# EAGLE design xbeeRFsocket-v01 (EAGLE 5.11)
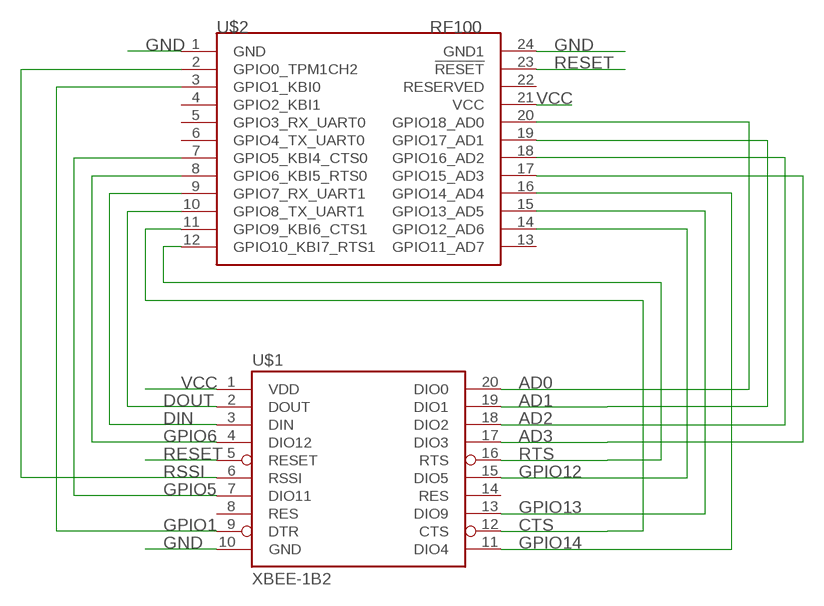
[diagram p0: schematic, sheet 1]

## Parts
U$1  XBEE-1B2  [XBEE-SILK]
U$2  SYNAPSEWIRELESS-RFENGINE  [SYNAPSERFENGINE-THM-SMT]

## Nets
AD0: U$1.20(DIO0) U$2.20(GPIO18_AD0)
AD1: U$1.19(DIO1) U$2.19(GPIO17_AD1)
AD2: U$1.18(DIO2) U$2.18(GPIO16_AD2)
AD3: U$1.17(DIO3) U$2.17(GPIO15_AD3)
CTS: U$1.12(CTS) U$2.11(GPIO9_KBI6_CTS1)
DIN: U$1.3(DIN) U$2.9(GPIO7_RX_UART1)
DOUT: U$1.2(DOUT) U$2.10(GPIO8_TX_UART1)
GND: U$1.10(GND) U$2.1(GND) U$2.24(GND1)
GPIO1: U$1.9(DTR) U$2.3(GPIO1_KBI0)
GPIO5: U$1.7(DIO11) U$2.7(GPIO5_KBI4_CTS0)
GPIO6: U$1.4(DIO12) U$2.8(GPIO6_KBI5_RTS0)
GPIO12: U$1.15(DIO5) U$2.14(GPIO12_AD6)
GPIO13: U$1.13(DIO9) U$2.15(GPIO13_AD5)
GPIO14: U$1.11(DIO4) U$2.16(GPIO14_AD4)
RESET: U$1.5(RESET) U$2.23(!RESET)
RSSI: U$1.6(RSSI) U$2.2(GPIO0_TPM1CH2)
RTS: U$1.16(RTS) U$2.12(GPIO10_KBI7_RTS1)
VCC: U$1.1(VDD) U$2.21(VCC)
Unconnected: U$1.8(RES) U$1.14(RES) U$2.4(GPIO2_KBI1) U$2.5(GPIO3_RX_UART0) U$2.6(GPIO4_TX_UART0) U$2.13(GPIO11_AD7) U$2.22(RESERVED)

## Library data of the parts
U$1 = SparkFun:XBEE-1
U$2 = 0_jc-custom:SYNAPSEWIRELESS-RFENGINE

## Net classes
0 default: width 0.305 mm

## Board
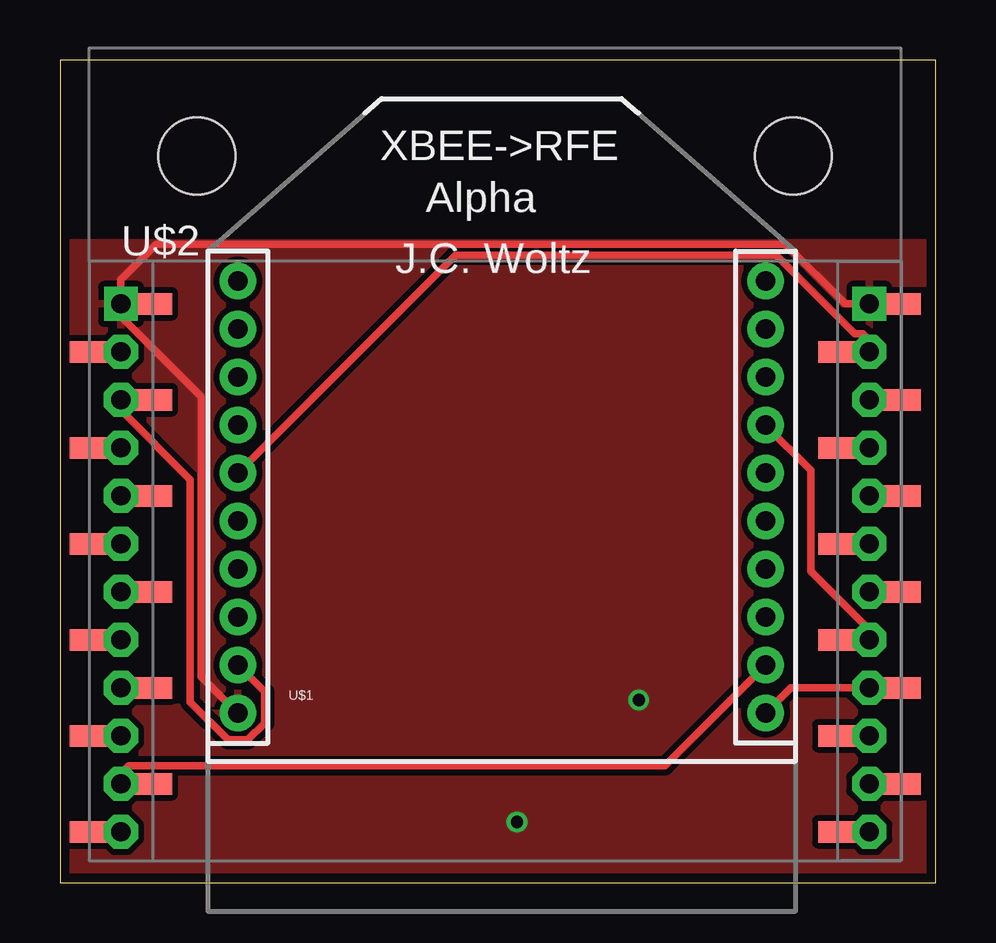
[diagram p1: board, top side]
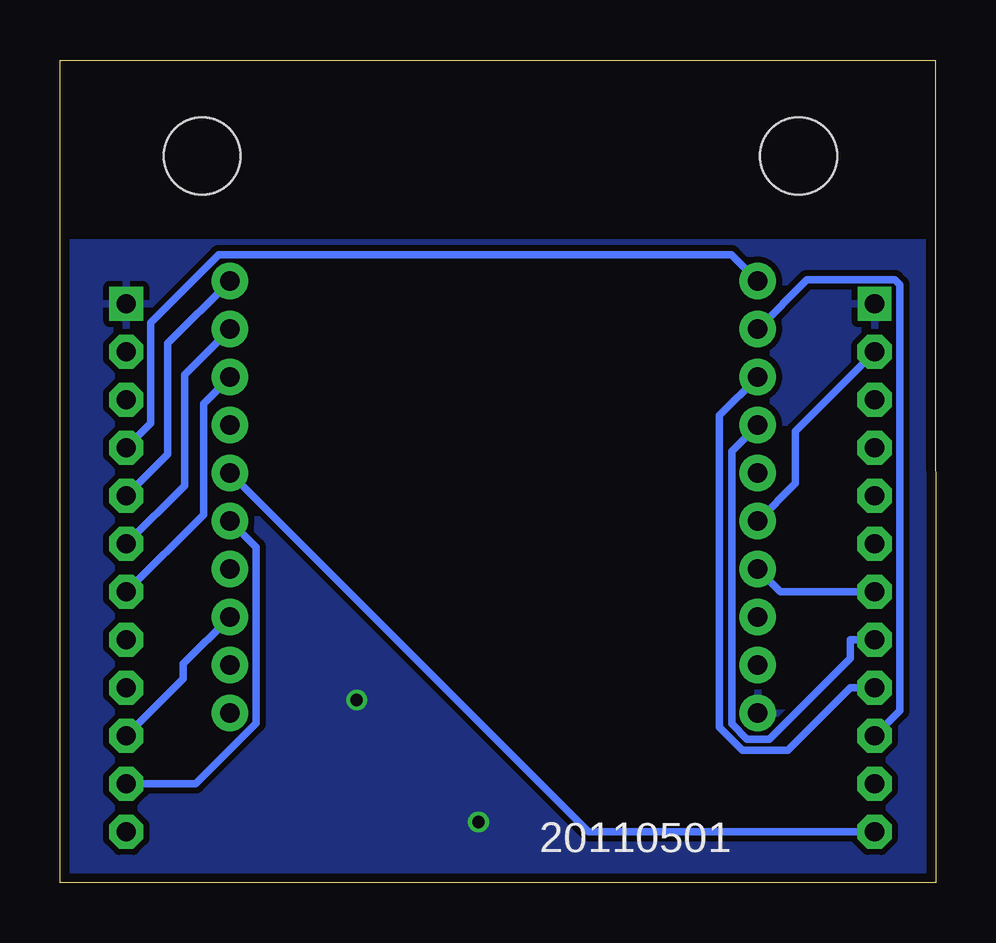
[diagram p2: board, bottom side, seen from below]

Size 36.5 x 34.29 mm. Coordinates in mm from the lower left corner, seen from the top.
Outline: 0,0 36.5,0 36.5,34.28 0.01,34.29 0,0
Copper layers (1*16): Top 0.0356mm / dielectric 1.5011mm / Bottom 0.0356mm
Design rules "LaenPCBOrder-JCModified": minimum track width 6mil, minimum drill 13mil, track to track 6mil, track to pad 6mil, pad to pad 6mil, via to via 6mil, smd to smd 6mil, copper to edge 15mil, drill to drill 6mil, minimum pad ring 12mil, minimum via ring 7mil, stop-mask expansion 4mil, vias tented up to drill 25mil, thermal gap 10mil

### Footprints (pad centres in the part's own frame; a part is rotated, then mirrored left to right if it is on the bottom)
XBEE-SILK = drill 0.8 pad 1.524 round: 1 -11,20; 2 -11,18; 3 -11,16; 4 -11,14; 5 -11,12; 6 -11,10; 7 -11,8; 8 -11,6; 9 -11,4; 10 -11,2; 11 11,2; 12 11,4; 13 11,6; 14 11,8; 15 11,10; 16 11,12; 17 11,14; 18 11,16; 19 11,18; 20 11,20
SYNAPSERFENGINE-THM-SMT = drill 0.8 square: 1 0,0; 24 31.2,0 | drill 0.8 pad 1.422 octagon: 2 0,-2; 3 0,-4; 4 0,-6; 5 0,-8; 6 0,-10; 7 0,-12; 8 0,-14; 9 0,-16; 10 0,-18; 11 0,-20; 12 0,-22; 13 31.2,-22; 14 31.2,-20; 15 31.2,-18; 16 31.2,-16; 17 31.2,-14; 18 31.2,-12; 19 31.2,-10; 20 31.2,-8; 21 31.2,-6; 22 31.2,-4; 23 31.2,-2 | smd 1.67 x 0.89: P1 1.3,0; P2 -1.3,-2; P3 1.3,-4; P4 -1.3,-6; P5 1.3,-8; P6 -1.3,-10; P7 1.3,-12; P8 -1.3,-14; P9 1.3,-16; P10 -1.3,-18; P11 1.3,-20; P12 -1.3,-22; P13 29.9,-22; P14 32.5,-20; P15 29.9,-18; P16 32.5,-16; P17 29.9,-14; P18 32.5,-12; P19 29.9,-10; P20 32.5,-8; P21 29.9,-6; P22 32.5,-4; P23 29.9,-2; P24 32.5,0 | hole 3.2: 3.17,6.16; 28.03,6.16

### Placement (x,y rotation side)
U$1  18.42,5.08 0 top
U$2  2.54,24.13 0 top

### Tracks (layer width: path | path; a pad name or v marks a point on that pad's centre or on a via)
AD0
  Bottom 0.305: U$2.20 32.02,17.85 32.02,22.48 U$1.20
AD1
  Bottom 0.305: U$1.19 31.31,21.18 31.31,16.56 U$2.19
AD2
  Bottom 0.305: U$2.18 30.52,15.35 30.52,19.98 U$1.18
AD3
  Top 0.305: U$2.17 33.74,10.55 31.3,12.99 31.3,17.2 U$1.17
CTS
  Top 0.305: U$2.11 2.54,4.55 2.87,4.88 25.21,4.88 U$1.12
DIN
  Bottom 0.305: U$2.9 3.56,8.13 6.15,5.53 8.04,5.53 9.01,6.5 9.01,19.49 U$1.3
DOUT
  Bottom 0.305: U$2.10 1.5,7.17 1.5,24.93 1.71,25.14 5.35,25.14 U$1.2
GND  (via drill 0.51)
  Top 0.305: U$2.24 32.73,24.13 30.25,26.61 4.01,26.61 2.54,25.14 U$2.1 2.54,23.62 5.89,20.27 5.89,8.6 U$1.10
  other vias: 24.13,7.62 19.05,2.54
  pour Top (isolate 0.254): -1.27,-1.27 -1.27,26.67 39.37,26.67 39.37,-1.27
  pour Bottom (isolate 0.254): -1.27,-1.27 -1.27,26.67 39.37,26.67 39.37,-1.27
GPIO1
  Top 0.305: U$1.9 8.53,7.97 8.53,6.66 7.82,5.96 7,5.96 5.44,7.53 5.44,16.81 2.54,19.71 U$2.3
GPIO5
  Bottom 0.305: U$2.7 6.46,12.13 U$1.7
GPIO6
  Bottom 0.305: U$2.8 3.56,10.13 3.56,9.37 6.93,5.99 7.85,5.99 8.5,6.63 8.5,18 U$1.4
GPIO12
  Bottom 0.305: U$2.14 30.84,4.13 28.33,6.64 28.33,13.99 U$1.15
GPIO13
  Bottom 0.305: U$2.15 31.36,8.51 31.36,9.14 U$1.13
GPIO14
  Top 0.305: U$2.16 30.46,8.13 U$1.11
RESET
  Top 0.305: U$2.23 33.74,22.6 33.46,22.88 33.14,22.88 29.87,26.16 16.49,26.16 U$1.5
RSSI
  Bottom 0.305: U$1.6 5.84,16.65 5.84,18.83 U$2.2
RTS
  Bottom 0.305: U$1.16 14.46,2.13 U$2.12
VCC
  Bottom 0.305: U$2.21 32.72,19.15 32.72,23.35 29.89,26.18 8.52,26.18 U$1.1

### Text on the board
tPlace: XBEE->RFE | Alpha | J.C. Woltz
bPlace: 20110501